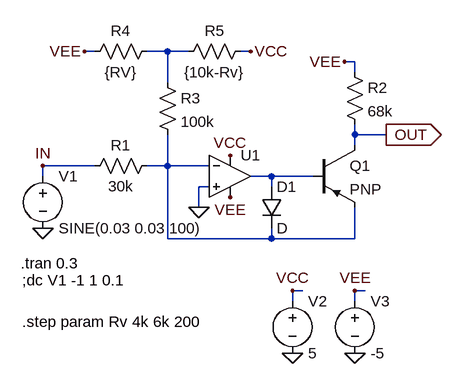
[diagram p0: schematic V-I Convert Scott Bernardi.asc]
V-I Convert Scott Bernardi.asc, the LTspice schematic file:
Version 4
SHEET 1 880 680
WIRE 112 -64 96 -64
WIRE 224 -64 192 -64
WIRE 256 -64 224 -64
WIRE 352 -64 336 -64
WIRE 512 -48 496 -48
WIRE 512 -32 512 -48
WIRE 224 -16 224 -64
WIRE 512 64 512 48
WIRE 560 64 512 64
WIRE 512 80 512 64
WIRE 112 112 32 112
WIRE 224 112 224 64
WIRE 224 112 192 112
WIRE 288 112 224 112
WIRE 32 128 32 112
WIRE 384 128 352 128
WIRE 448 128 384 128
WIRE 288 144 272 144
WIRE 384 144 384 128
WIRE 272 176 272 144
WIRE 224 224 224 112
WIRE 384 224 384 208
WIRE 384 224 224 224
WIRE 512 224 512 176
WIRE 512 224 384 224
WIRE 432 304 416 304
WIRE 528 304 512 304
WIRE 416 320 416 304
WIRE 512 320 512 304
FLAG 272 176 0
FLAG 320 96 VCC
FLAG 320 160 VEE
FLAG 32 208 0
FLAG 416 400 0
FLAG 512 400 0
FLAG 416 304 VCC
FLAG 512 304 VEE
FLAG 560 64 OUT
IOPIN 560 64 Out
FLAG 32 112 IN
FLAG 352 -64 VCC
FLAG 96 -64 VEE
FLAG 496 -48 VEE
SYMBOL res 208 96 R90
WINDOW 0 0 56 VBottom 2
WINDOW 3 32 56 VTop 2
SYMATTR InstName R1
SYMATTR Value 30k
SYMBOL Opamps\\UniversalOpamp2 320 128 R0
SYMATTR InstName U1
SYMBOL diode 368 144 R0
SYMATTR InstName D1
SYMBOL pnp 448 80 R0
SYMATTR InstName Q1
SYMBOL res 496 -48 R0
SYMATTR InstName R2
SYMATTR Value 68k
SYMBOL voltage 32 112 R0
WINDOW 123 0 0 Left 2
WINDOW 39 0 0 Left 2
SYMATTR InstName V1
SYMATTR Value SINE(0.03 0.03 100)
SYMBOL voltage 416 304 R0
SYMATTR InstName V2
SYMATTR Value 5
SYMBOL voltage 512 304 R0
WINDOW 123 0 0 Left 2
WINDOW 39 0 0 Left 2
SYMATTR InstName V3
SYMATTR Value -5
SYMBOL res 208 -32 R0
SYMATTR InstName R3
SYMATTR Value 100k
SYMBOL res 208 -80 R90
WINDOW 0 0 56 VBottom 2
WINDOW 3 32 56 VTop 2
SYMATTR InstName R4
SYMATTR Value {RV}
SYMBOL res 352 -80 R90
WINDOW 0 0 56 VBottom 2
WINDOW 3 32 56 VTop 2
SYMATTR InstName R5
SYMATTR Value {10k-Rv}
TEXT -2 262 Left 2 !.tran 0.3
TEXT 0 288 Left 2 !;dc V1 -1 1 0.1
TEXT 0 352 Left 2 !.step param Rv 4k 6k 200

The netlist it stands for:
* V-I Convert Scott Bernardi.asc
R1 N002 IN 30k
XU1 0 N002 VCC VEE N003 level.2 Avol=1Meg GBW=10Meg Slew=10Meg ilimit=25m rail=0 Vos=0 phimargin=45 en=0 enk=0 in=0 ink=0 Rin=500Meg  ; pins IN+ IN- V+ V- OUT
D1 N003 N002 D
Q1 OUT N003 N002 0 PNP
R2 VEE OUT 68k
V1 IN 0 SINE(0.03 0.03 100)
V2 VCC 0 5
V3 VEE 0 -5
R3 N001 N002 100k
R4 N001 VEE {RV}
R5 VCC N001 {10k-Rv}
.model D D
.lib standard.dio
.model NPN NPN
.model PNP PNP
.lib standard.bjt
.tran 0.3
;dc V1 -1 1 0.1
.step param Rv 4k 6k 200
.lib UniversalOpamps2.sub
.backanno
.end